# EAGLE design nivel0 (EAGLE 6.1)

## Sheet 1 of 5: Base
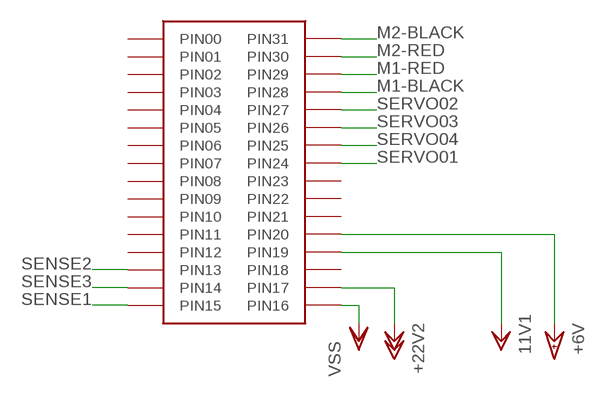
[diagram p0: schematic, sheet 1]

### Parts
U$1  BASE  [BASE]

### Nets
+6V: U$1.PIN20 ; also sheet 4
+11V1: U$1.PIN19 ; supply symbol labelled 11V1 ; also sheet 2
+22V: U$1.PIN17 ; supply symbol labelled +22V2 ; also sheet 2
M1-BLACK: U$1.PIN28 ; also sheet 5
M1-RED: U$1.PIN29 ; also sheet 5
M2-BLACK: U$1.PIN31 ; also sheet 5
M2-RED: U$1.PIN30 ; also sheet 5
SENSE1: U$1.PIN15 ; also sheet 3
SENSE2: U$1.PIN13 ; also sheet 3
SENSE3: U$1.PIN14 ; also sheet 3
SERVO01: U$1.PIN24 ; also sheet 4
SERVO02: U$1.PIN27 ; also sheet 4
SERVO03: U$1.PIN26 ; also sheet 4
SERVO04: U$1.PIN25 ; also sheet 4
VSS: U$1.PIN16 ; also sheet 2,3,4
Unconnected: U$1.PIN00 U$1.PIN01 U$1.PIN02 U$1.PIN03 U$1.PIN04 U$1.PIN05 U$1.PIN06 U$1.PIN07 U$1.PIN08 U$1.PIN09 U$1.PIN10 U$1.PIN11 U$1.PIN12 U$1.PIN18 U$1.PIN21 U$1.PIN22 U$1.PIN23

## Sheet 2 of 5: Alimentación
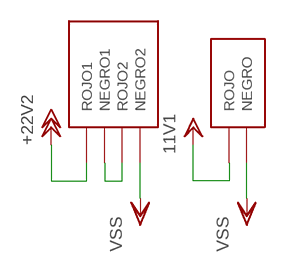
[diagram p1: schematic, sheet 2]

### Parts
U$11  CONECTOR_AUDIO  [CONECTOR_AUDIO]
U$12  CONECTOR_AUDIO2  [CONECTOR_AUDIO2]

### Nets
+11V1: U$12.P$2(ROJO) ; supply symbol labelled 11V1 ; also sheet 1
+22V: U$11.P$1(ROJO1) ; supply symbol labelled +22V2 ; also sheet 1
N$1: U$11.P$2(NEGRO1) U$11.P$3(ROJO2)
VSS: U$11.P$4(NEGRO2) U$12.P$1(NEGRO) ; also sheet 1,3,4

## Sheet 3 of 5: Monitor Baterias
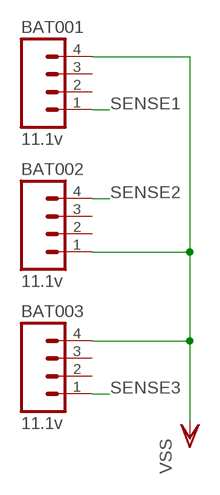
[diagram p2: schematic, sheet 3]

### Parts
BAT001  11.1v  M04LONGPADS  [1X04_LONGPADS]
BAT002  11.1v  M04LONGPADS  [1X04_LONGPADS]
BAT003  11.1v  M04LONGPADS  [1X04_LONGPADS]

### Nets
SENSE1: BAT001.1 ; also sheet 1
SENSE2: BAT002.4 ; also sheet 1
SENSE3: BAT003.1 ; also sheet 1
VSS: BAT001.4 BAT002.1 BAT003.4 ; also sheet 1,2,4
Unconnected: BAT001.2 BAT001.3 BAT002.2 BAT002.3 BAT003.2 BAT003.3

## Sheet 4 of 5: Servo Connection
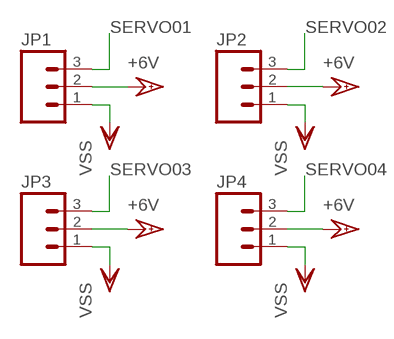
[diagram p3: schematic, sheet 4]

### Parts
JP1  M03LONGPADS  [1X03_LONGPADS]
JP2  M03LONGPADS  [1X03_LONGPADS]
JP3  M03LONGPADS  [1X03_LONGPADS]
JP4  M03LONGPADS  [1X03_LONGPADS]

### Nets
+6V: JP1.2 JP2.2 JP3.2 JP4.2 ; also sheet 1
SERVO01: JP1.3 ; also sheet 1
SERVO02: JP2.3 ; also sheet 1
SERVO03: JP3.3 ; also sheet 1
SERVO04: JP4.3 ; also sheet 1
VSS: JP1.1 JP2.1 JP3.1 JP4.1 ; also sheet 1,2,3

## Sheet 5 of 5: MOTOR CONNECTION
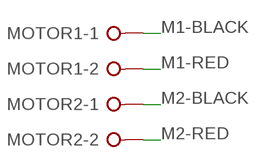
[diagram p4: schematic, sheet 5]

### Parts
MOTOR1  W237-02P  [W237-132]
MOTOR2  W237-02P  [W237-132]

### Nets
M1-BLACK: MOTOR1.1 ; also sheet 1
M1-RED: MOTOR1.2 ; also sheet 1
M2-BLACK: MOTOR2.1 ; also sheet 1
M2-RED: MOTOR2.2 ; also sheet 1

## Library data of the parts
BAT001-BAT003 = SparkFun:M04: Header 4 Standard 4-pin 0.1" header. Use with straight break away headers (SKU : PRT-00116), right angle break away headers (PRT-00553), swiss pins (PRT-00743), machine pins (PRT-00117), and female headers (PRT-00115). Molex polarized connector foot print use with SKU : PRT-08231 with associated crimp pins and housings. 1MM SMD Version SKU: PRT-10208
JP1-JP4 = SparkFun:M03: Header 3 Standard 3-pin 0.1" header. Use with straight break away headers (SKU : PRT-00116), right angle break away headers (PRT-00553), swiss pins (PRT-00743), machine pins (PRT-00117), and female headers (PRT-00115). Molex polarized connector foot print use with SKU : PRT-08232 with associated crimp pins and housings.
MOTOR1 MOTOR2 = con-wago-508:W237-02P: WAGO SREW CLAMP; OC_FARNELL: unknown; OC_NEWARK: unknown
U$1 = aasanchez:BASE
U$11 = aasanchez:CONECTOR_AUDIO
U$12 = aasanchez:CONECTOR_AUDIO2

## Board
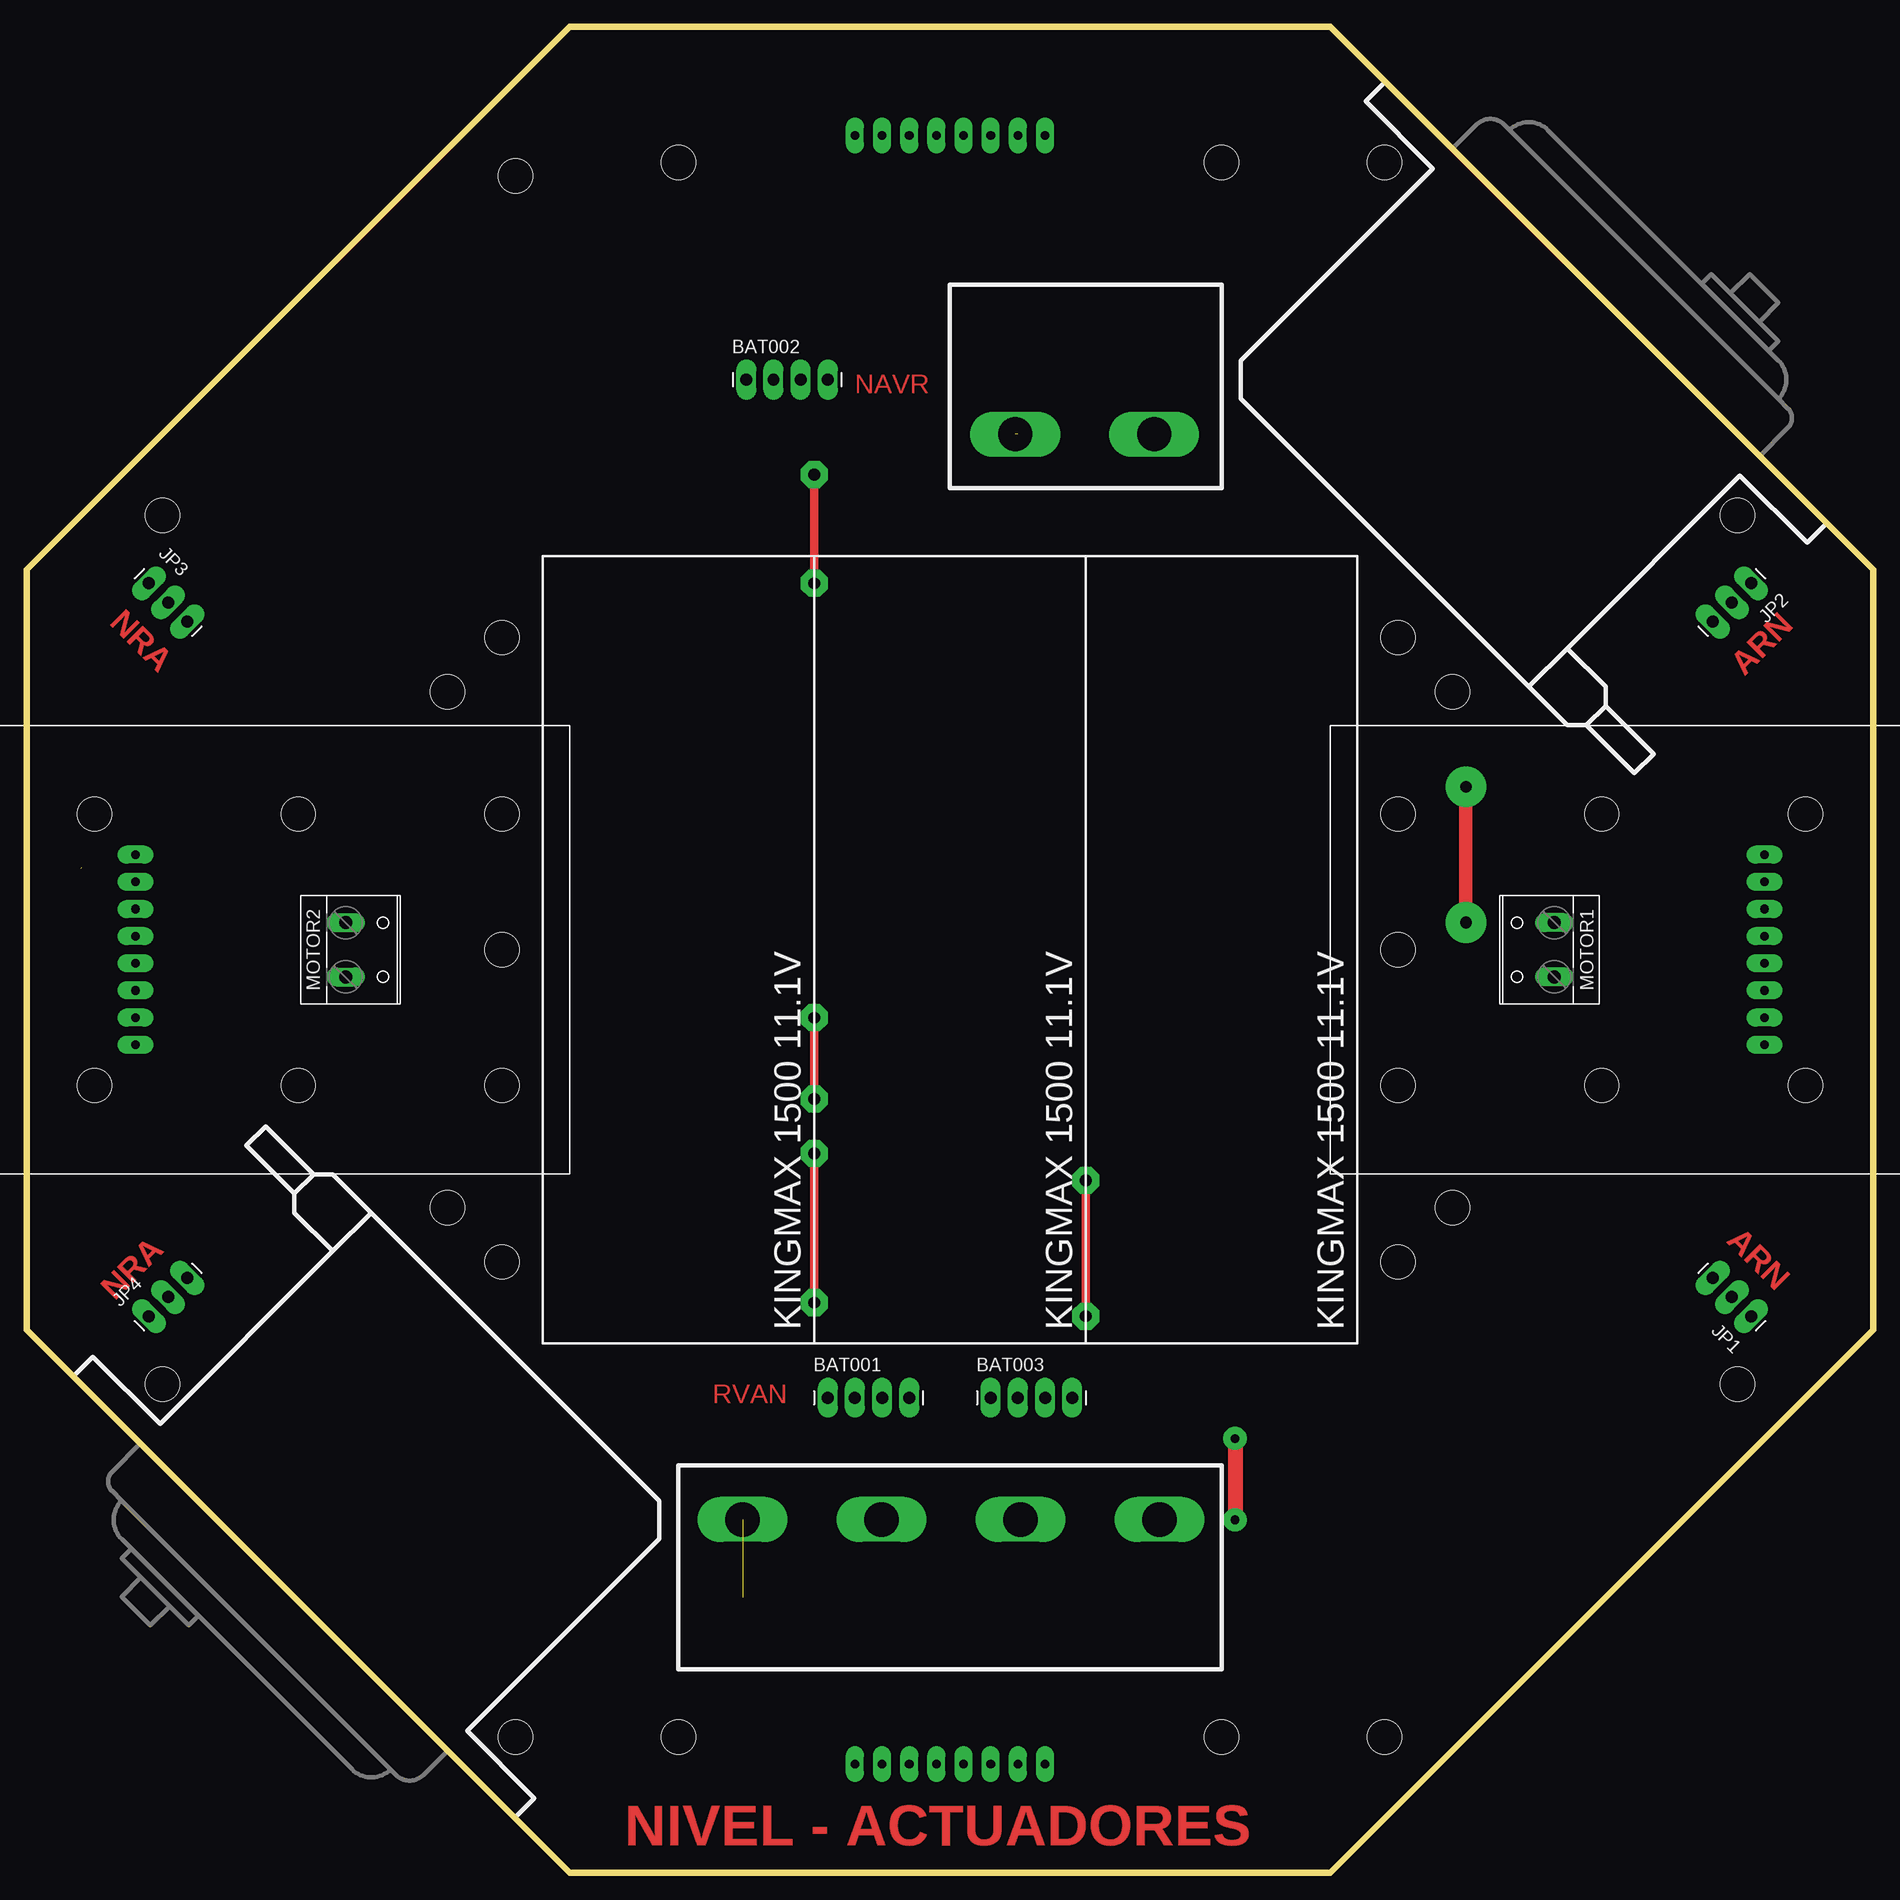
[diagram p5: board, top side]
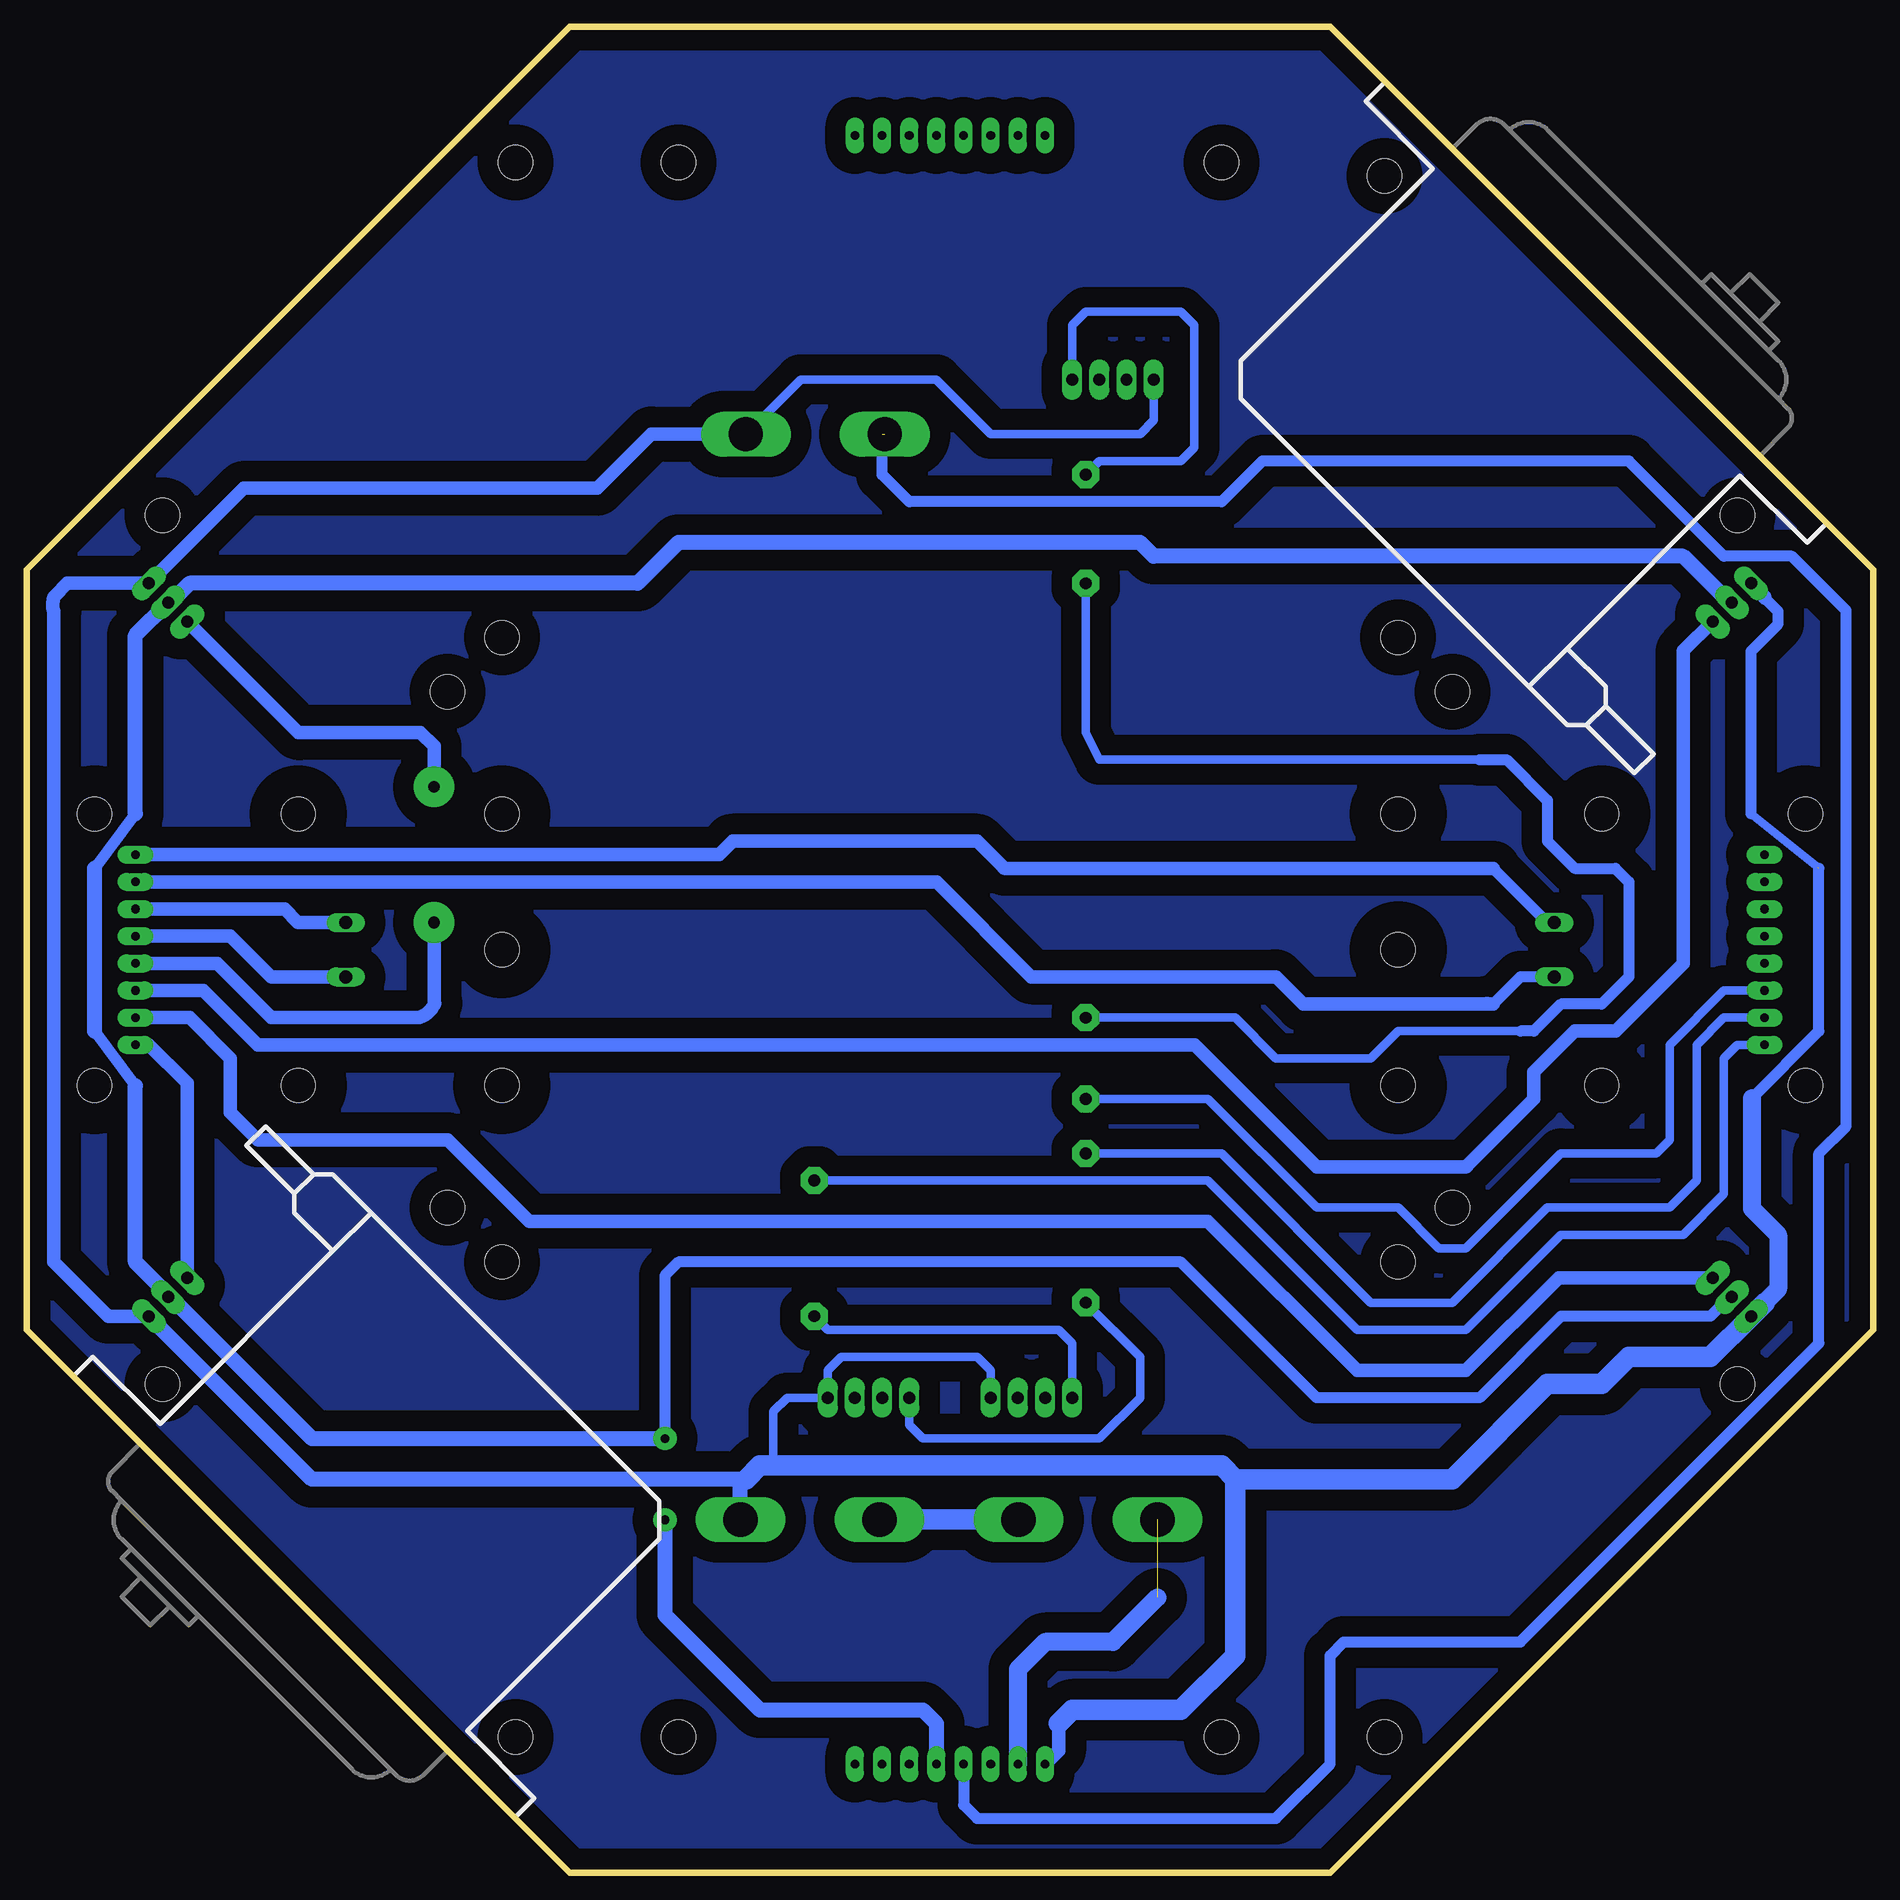
[diagram p6: board, bottom side, seen from below]

Size 172.72 x 172.72 mm. Coordinates in mm from the lower left corner, seen from the top.
Copper layers (1*16): Top 0.035mm / dielectric 1.5mm / Bottom 0.035mm
Design rules: minimum track width 10mil, minimum drill 24mil, track to track 8mil, track to pad 8mil, pad to pad 8mil, via to via 8mil, smd to smd 8mil, copper to edge 40mil, drill to drill 8mil, minimum pad ring 10mil, minimum via ring 8mil, stop-mask expansion 4mil, vias tented up to drill 0mil, thermal gap 10mil
Holes 3.2 mm at 44.45,115.57 128.27,115.57 44.45,57.15 128.27,57.15 39.37,110.49 39.37,62.23 133.35,62.23 133.35,110.49 12.7,127 45.72,158.75 127,160.02 160.02,127 160.02,45.72 127,12.7 45.72,12.7 12.7,45.72

### Footprints (pad centres in the part's own frame; a part is rotated, then mirrored left to right if it is on the bottom)
1X04_LONGPADS = drill 1.118 pad 1.88 long: 1 0,0; 2 2.54,0; 3 5.08,0; 4 7.62,0
1X03_LONGPADS = drill 1.118 pad 1.88 long: 1 0,0; 2 2.54,0; 3 5.08,0
W237-132 = drill 1.194 long: 1 -2.54,-0.635; 2 2.54,-0.635
BASE = drill 0.8 pad 1.676 long: PIN00 8.89,76.2; PIN01 6.35,76.2; PIN02 3.81,76.2; PIN03 1.27,76.2; PIN04 -1.27,76.2; PIN05 -3.81,76.2; PIN06 -6.35,76.2; PIN07 -8.89,76.2; PIN08 -76.2,8.89; PIN09 -76.2,6.35; PIN10 -76.2,3.81; PIN11 -76.2,1.27; PIN12 -76.2,-1.27; PIN13 -76.2,-3.81; PIN14 -76.2,-6.35; PIN15 -76.2,-8.89; PIN16 -8.89,-76.2; PIN17 -6.35,-76.2; PIN18 -3.81,-76.2; PIN19 -1.27,-76.2; PIN20 1.27,-76.2; PIN21 3.81,-76.2; PIN22 6.35,-76.2; PIN23 8.89,-76.2; PIN24 76.2,-8.89; PIN25 76.2,-6.35; PIN26 76.2,-3.81; PIN27 76.2,-1.27; PIN28 76.2,1.27; PIN29 76.2,3.81; PIN30 76.2,6.35; PIN31 76.2,8.89 | hole 3.2: -25.4,73.66; 25.4,73.66; -25.4,-73.66; 25.4,-73.66
BASEMOTOR = hole 3.2: -19.05,-12.7; 0,-12.7; 19.05,-12.7; 19.05,12.7; 0,12.7; -19.05,12.7; -19.05,0
CONECTOR_AUDIO = drill 3.2 long: P$1 6,14; P$2 19,14; P$3 32,14; P$4 45,14
CONECTOR_AUDIO2 = drill 3.2 long: P$1 6.3,14; P$2 19.3,14

### Placement (x,y rotation side)
BAT001  74.93,44.45 0 top
BAT002  67.31,139.7 0 top
BAT003  90.17,44.45 0 top
JP1  161.29,52.07 135 top
JP2  161.29,120.65 225 top
JP3  11.43,120.65 315 top
JP4  11.43,52.07 45 top
MOTOR1  142.24,86.36 90 top
MOTOR2  30.48,86.36 270 top
U$1  86.36,86.36 0 top
U$2  [KINGMAX1500]  86.36,86.36 0 top
U$3  [KINGMAX1500]  111.76,86.36 0 top
U$4  [KINGMAX1500]  60.96,86.36 0 top
U$5  [BASEMOTOR]  25.4,86.36 180 top
U$6  [BASEMOTOR]  147.32,86.36 0 top
U$7  [SERVOBODY]  60.96,139.7 315 bottom
U$8  [SERVOBODY]  111.76,33.02 135 bottom
U$9  [SERVOBODY]  111.76,139.7 315 top
U$10  [SERVOBODY]  60.96,33.02 135 top
U$11  60.96,19.05 0 top
U$12  111.76,148.59 180 top

### Tracks (layer width: path | path; a pad name or v marks a point on that pad's centre or on a via)
+6V  (via drill 0.8 pad 2.18)
  Top 1.422: v113.03,40.64 v113.03,33.02
  Bottom 1.016: 162.56,73.66 166.37,78.74 | 166.37,93.98 162.56,99.06 | JP4.2 13.44,53.87 15.24,52.07 29.21,52.07 36.83,44.45 52.07,44.45 64.77,57.15 111.76,57.15 113.03,55.88 v113.03,40.64
  Bottom 1.422: JP3.2 13.44,118.85 17.78,123.19 67.31,123.19 68.58,124.46 111.76,124.46 115.57,120.65 157.48,120.65 159.28,118.85 JP2.2 162.56,115.79 162.56,99.06 | 162.56,73.66 162.56,57.15 159.49,54.08 JP1.2 159.28,53.87 146.05,40.64 v113.03,40.64 | 166.37,78.74 166.37,93.98 | v113.03,33.02 113.03,24.13 104.14,15.24 88.9,15.24 87.63,13.97 U$1.PIN20
+11V1  (1 unrouted)
  Bottom 1.016: U$1.PIN19 85.09,6.35 83.82,5.08 55.88,5.08 50.8,10.16 50.8,20.32 49.53,21.59 33.02,21.59 5.08,49.53 5.08,67.31 2.54,69.85 2.54,118.11 7.62,123.19 13.97,123.19 22.86,132.08 57.15,132.08 60.96,128.27 90.17,128.27 92.71,130.81 92.71,134.62
+22V  (1 unrouted)
  Bottom 1.676: 66.96,25.75 71.12,21.59 77.47,21.59 80.01,19.05 U$1.PIN17
M1-BLACK
  Bottom 1.27: MOTOR1.1 149.75,83.82 arc45 149.93,83.89 153.67,87.63 U$1.PIN28
M1-RED
  Bottom 1.27: MOTOR1.2 147.22,88.9 arc45 147.39,88.97 148.59,90.17 U$1.PIN29
M2-BLACK
  Bottom 1.016: MOTOR2.1 30.48,88.9 35.56,93.98
  Bottom 1.27: 35.56,93.98 81.17,93.98 arc45 81.35,94.05 83.82,96.52 106.68,96.52 arc-45 106.75,96.45 107.95,95.25 U$1.PIN31
M2-RED
  Bottom 1.016: MOTOR2.2 33.02,83.82 35.56,81.28
  Bottom 1.27: U$1.PIN30 87.73,92.71 arc45 87.56,92.64 78.74,83.82 55.98,83.82 arc45 55.81,83.75 53.34,81.28 36.3,81.28 | 35.56,81.28 36.3,81.28 | 36.3,81.28 arc-45 36.12,81.35
N$1
  Bottom 1.93: U$11.P$2 U$11.P$3
N$2
  pour Bottom (isolate 1.93): 50.8,0 121.92,0 172.72,50.8 172.72,121.92 121.92,172.72 50.8,172.72 0,121.92 0,50.8
SENSE1  (via drill 1.1 pad 2.54)
  Top 0.813: v99.06,52.07 v99.06,64.77
  Bottom 0.813: BAT001.1 74.93,49.53 76.2,50.8 97.79,50.8 v99.06,52.07 | v99.06,64.77 62.23,64.77 48.26,50.8 38.1,50.8 29.21,59.69 17.78,59.69 13.97,63.5 13.97,76.2 12.7,77.47 U$1.PIN15
SENSE2  (via drill 1.1 pad 2.54)
  Top 0.813: v73.66,130.81 v73.66,120.65 | v73.66,80.01 v73.66,72.39
  Bottom 0.813: BAT002.4 74.93,144.78 73.66,146.05 64.77,146.05 63.5,144.78 63.5,133.35 64.77,132.08 72.39,132.08 v73.66,130.81 | v73.66,120.65 73.66,106.68 72.39,104.14 36.83,104.14 | 33.02,78.74 44.45,78.74 46.99,76.2 55.88,76.2 59.69,80.01 v73.66,80.01 | v73.66,72.39 62.23,72.39 52.07,62.23 44.45,62.23 40.64,58.42 38.1,58.42 29.21,67.31 20.32,67.31 19.05,68.58 19.05,77.47 13.97,82.55 U$1.PIN13
  Bottom 1.016: 36.83,104.14 34.29,104.14 30.48,100.33 30.48,96.52 27.94,93.98 24.13,93.98 22.86,92.71 22.86,83.82 25.4,81.28 29.21,81.28 31.75,78.74 33.02,78.74
SENSE3  (via drill 1.1 pad 2.54)
  Top 0.813: v73.66,53.34 v73.66,67.31
  Bottom 0.813: BAT003.1 90.17,41.91 88.9,40.64 72.39,40.64 68.58,44.45 68.58,48.26 v73.66,53.34 | v73.66,67.31 60.96,67.31 46.99,53.34 39.37,53.34 30.48,62.23 19.05,62.23 16.51,64.77 16.51,77.47 13.97,80.01 U$1.PIN14
SERVO01
  Bottom 1.27: JP1.3 157.7,73.77 arc-45 157.77,73.95 161.29,77.47 U$1.PIN24
SERVO02  (via drill 1.1 pad 3.81)
  Top 1.27: v134.62,88.9 v134.62,101.6
  Bottom 1.27: U$1.PIN27 155.04,85.09 arc45 154.87,85.02 149.86,80.01 136,80.01 arc-45 134.55,81.35 134.62,81.28 v134.62,88.9 | v134.62,101.6 134.62,105.41 135.89,106.68 147.22,106.68 arc45 147.39,106.75 JP2.3
SERVO03
  Bottom 1.27: U$1.PIN26 156.31,82.55 arc45 156.14,82.48 151.13,77.47 63.61,77.47 arc45 63.43,77.4 52.07,66.04 38.2,66.04 arc-45 38.03,66.11 31.75,72.39 31.75,74.93 27.94,78.74 24.23,78.74 arc-45 24.06,78.81 17.78,85.09 17.78,114.2 arc45 17.71,114.37 JP3.3
SERVO04
  Bottom 1.27: U$1.PIN25 157.48,80.01 153.67,76.2 153.67,71.12 151.2,68.65 arc-45 151.03,68.58 133.35,68.58 125.8,61.03 arc-45 125.62,60.96 62.23,60.96 48.26,46.99 38.1,46.99 29.43,55.66 JP4.3
VSS  (1 unrouted)
  Bottom 0.813: 5.15,94.05 11.43,99.06 | BAT001.4 82.55,46.99 83.82,48.26 96.52,48.26 97.79,46.99 BAT003.4 101.6,44.45 102.87,43.18 102.87,38.1 | BAT002.1 67.31,135.89 68.58,134.62 82.55,134.62 87.63,139.7 100.33,139.7 105.44,134.59 U$12.P$1
  Bottom 1.016: 11.36,72.46 5.08,78.74 5.08,93.98 | 11.43,99.06 11.43,114.3 8.89,116.84 8.89,118.01 10.16,119.28
  Bottom 1.27: 10.16,119.28 arc-45 10.23,119.45 JP3.1 | JP1.1 165,52.07 arc45 165.17,52.14 170.18,57.15 170.18,118.01 arc45 170.11,119.45 168.91,120.65 JP2.1 152.4,129.54 119.48,129.54 arc-45 119.31,129.61 114.3,134.62 105.53,134.62 arc45 U$12.P$1 | 76.2,13.97 76.2,11.43 U$1.PIN16
  Bottom 1.422: JP1.1 146.05,36.83 105.41,36.83 105.96,36.28 U$11.P$4
  Bottom 1.676: 11.36,72.46 11.36,62.16 8.89,59.69 8.89,54.61 JP4.1
  Bottom 1.93: 105.41,36.83 104.14,38.1 102.87,38.1 60.96,38.1 59.69,36.83 | 59.69,36.83 59.69,20.32 64.77,15.24 74.93,15.24 76.2,13.97 | 59.69,36.83 39.37,36.83 30.48,45.72 25.4,45.72 22.86,48.26 15.24,48.26 JP4.1 10.16,53.34

### Text on the board
Top: NAVR | ARN | NRA | NRA | ARN | RVAN | NIVEL - ACTUADORES